# EAGLE design HighPass_V_1_0 (EAGLE 9.5.2)
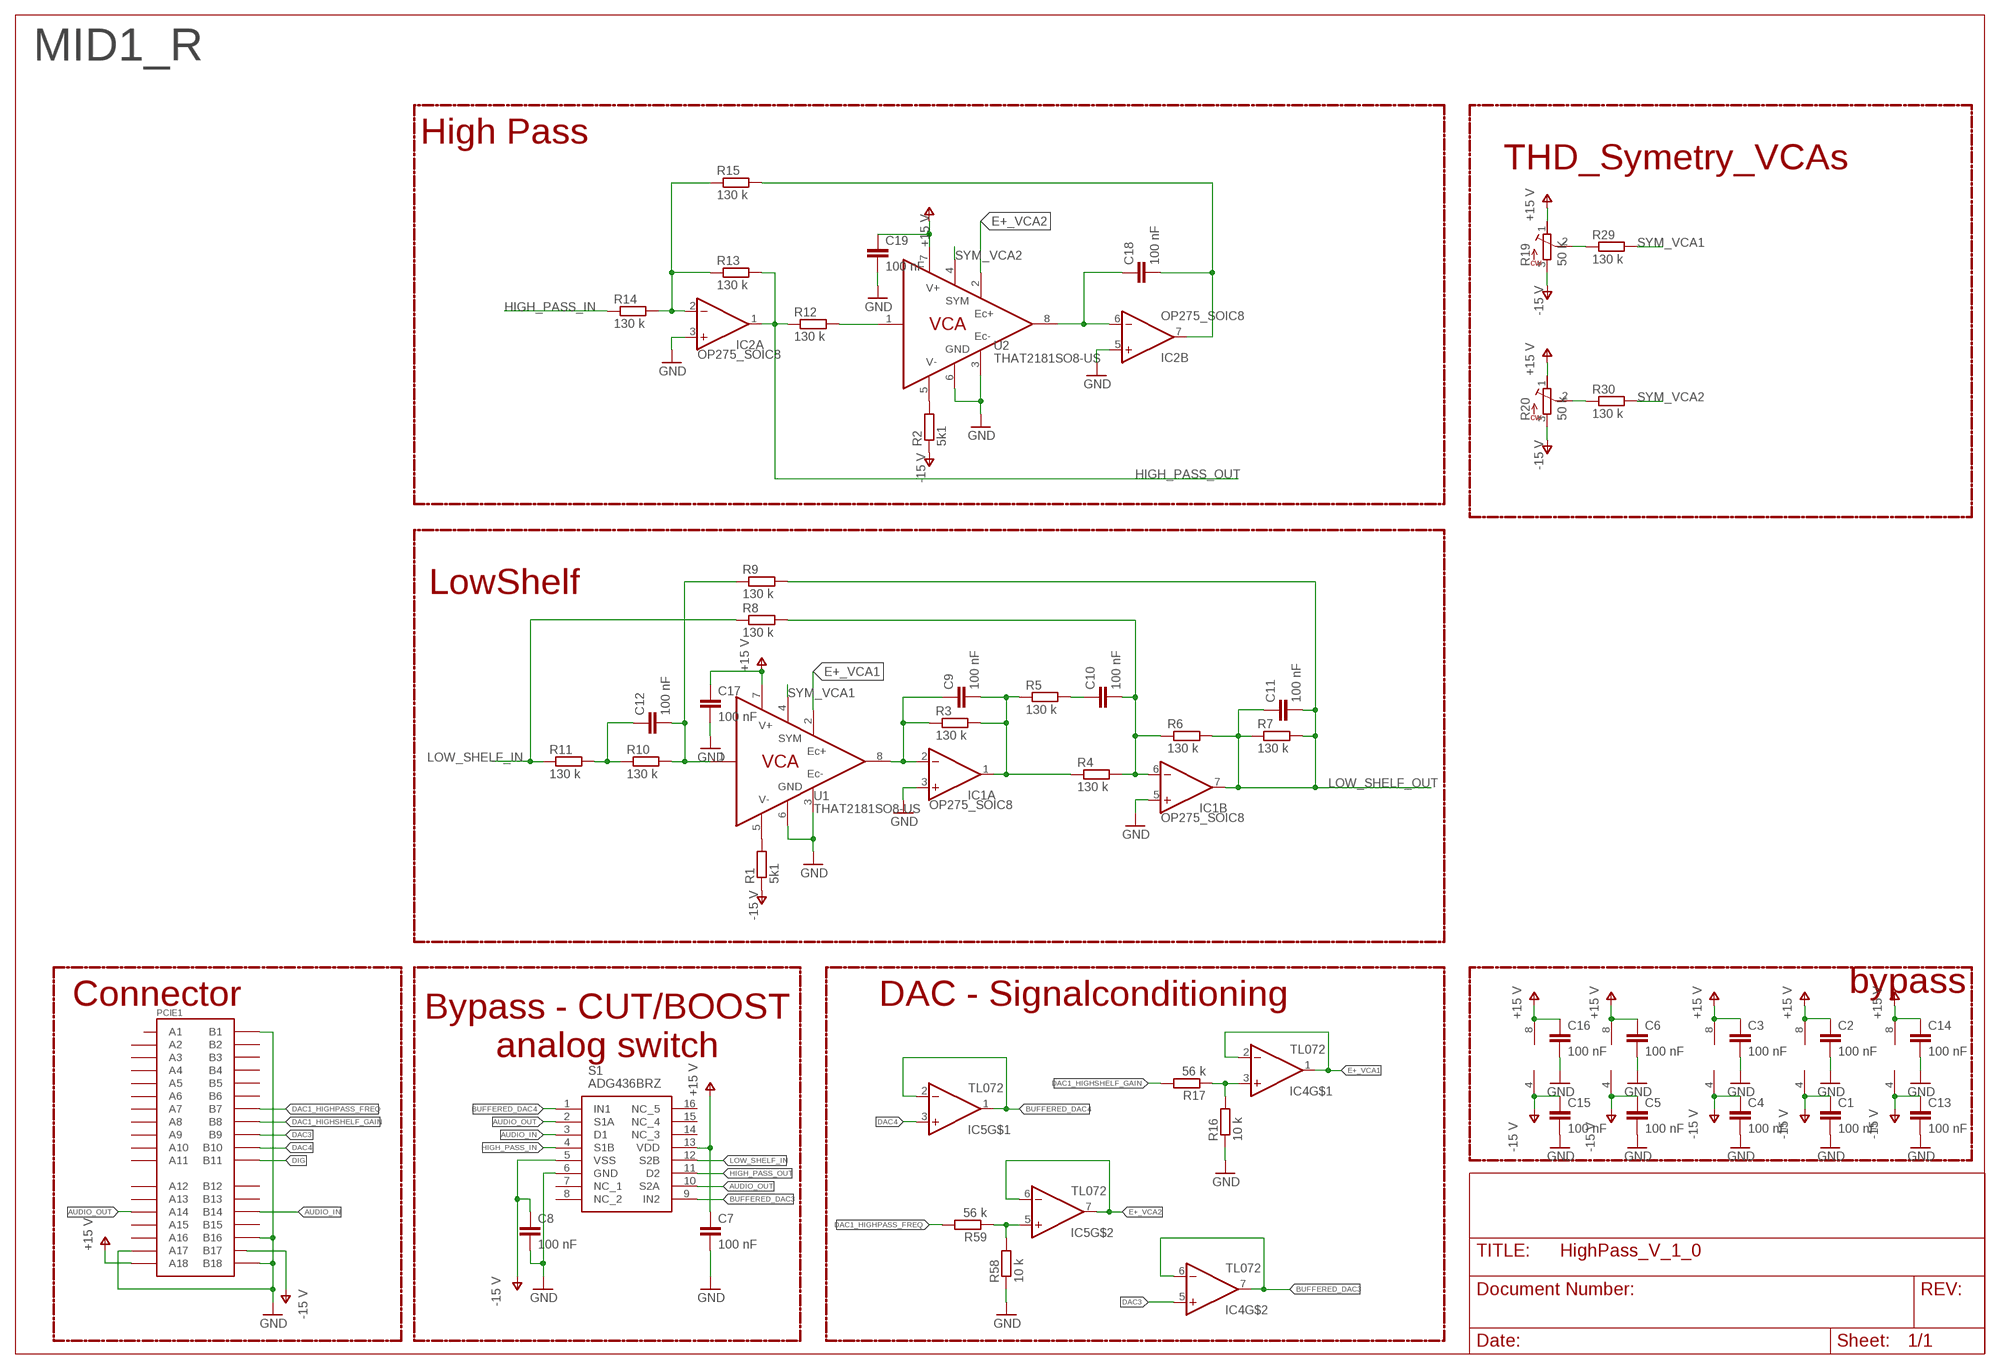
[diagram p0: schematic, sheet 1]

## Parts
C1  100 nF  CAPACITOR_0603  [C0603]
C2  100 nF  CAPACITOR_0603  [C0603]
C3  100 nF  CAPACITOR_0603  [C0603]
C4  100 nF  CAPACITOR_0603  [C0603]
C5  100 nF  CAPACITOR_0603  [C0603]
C6  100 nF  CAPACITOR_0603  [C0603]
C7  100 nF  CAPACITOR_0603  [C0603]
C8  100 nF  CAPACITOR_0603  [C0603]
C9  100 nF  CAPACITOR_0603  [C0603]
C10  100 nF  CAPACITOR_0603  [C0603]
C11  100 nF  CAPACITOR_0603  [C0603]
C12  100 nF  CAPACITOR_0603  [C0603]
C13  100 nF  CAPACITOR_0603  [C0603]
C14  100 nF  CAPACITOR_0603  [C0603]
C15  100 nF  CAPACITOR_0603  [C0603]
C16  100 nF  CAPACITOR_0603  [C0603]
C17  100 nF  CAPACITOR_0603  [C0603]
C18  100 nF  CAPACITOR_0603  [C0603]
C19  100 nF  CAPACITOR_0603  [C0603]
IC1  OP275_SOIC8  [SOIC8]
IC2  OP275_SOIC8  [SOIC8]
IC3  OP275_SOIC8  [SOIC8]
IC4  TL072  [SOIC8]
IC5  TL072  [SOIC8]
PCIE1  PCIE-36-EDGE  [PCIE-36-EDGE]
R1  5k1  RESISTOR_0603  [R0603]
R2  5k1  RESISTOR_0603  [R0603]
R3  130 k  RESISTOR_0603  [R0603]
R4  130 k  RESISTOR_0603  [R0603]
R5  130 k  RESISTOR_0603  [R0603]
R6  130 k  RESISTOR_0603  [R0603]
R7  130 k  RESISTOR_0603  [R0603]
R8  130 k  RESISTOR_0603  [R0603]
R9  130 k  RESISTOR_0603  [R0603]
R10  130 k  RESISTOR_0603  [R0603]
R11  130 k  RESISTOR_0603  [R0603]
R12  130 k  RESISTOR_0603  [R0603]
R13  130 k  RESISTOR_0603  [R0603]
R14  130 k  RESISTOR_0603  [R0603]
R15  130 k  RESISTOR_0603  [R0603]
R16  10 k  RESISTOR_0603  [R0603]
R17  56 k  RESISTOR_0603  [R0603]
R19  50 K  R_TRIMMER_SMDTC33X2503G  [TC33X2503G]
R20  50 k  R_TRIMMER_SMDTC33X2503G  [TC33X2503G]
R29  130 k  RESISTOR_0603  [R0603]
R30  130 k  RESISTOR_0603  [R0603]
R58  10 k  RESISTOR_0603  [R0603]
R59  56 k  RESISTOR_0603  [R0603]
S1  ADG436BRZ  [SOIC127P600X175-16N]
U1  THAT2181SO8-US  [SO08]
U2  THAT2181SO8-US  [SO08]

## Nets
AUDIO_IN: PCIE1.B14 S1.3(D1)
AUDIO_OUT: PCIE1.A14 S1.2(S1A) S1.10(S2A)
BUFFERED_DAC3: IC4.6(-IN) IC4.7(OUT) S1.9(IN2)
BUFFERED_DAC4: IC5.1(OUT) IC5.2(-IN) S1.1(IN1)
DAC1_HIGHPASS_FREQ: PCIE1.B7 R59.2
DAC1_HIGHSHELF_GAIN: PCIE1.B8 R17.2
DAC3: IC4.5(+IN) PCIE1.B9
DAC4: IC5.3(+IN) PCIE1.B10
DIG: PCIE1.B11
E+_VCA1: IC4.1(OUT) IC4.2(-IN) U1.2(EC+)
E+_VCA2: IC5.6(-IN) IC5.7(OUT) U2.2(EC+)
GND: C1.2 C2.2 C3.2 C4.2 C5.2 C6.2 C7.2 C8.2 C13.2 C14.2 C15.2 C16.2 C17.2 C19.2 IC1.3(A:+IN) IC1.5(B:+IN) IC2.3(A:+IN) IC2.5(B:+IN) PCIE1.A17 PCIE1.B1 PCIE1.B16 PCIE1.B18 R16.1 R58.1 S1.6(GND) U1.3(EC-) U1.6(GND) U2.3(EC-) U2.6(GND)
HIGH_PASS_IN: R14.1 S1.4(S1B)
HIGH_PASS_OUT: IC2.1(A:OUT) R12.1 R13.2 S1.11(D2)
LOW_SHELF_IN: R8.1 R11.1 S1.12(S2B)
LOW_SHELF_OUT: C11.1 C11.2 IC1.7(B:OUT) R6.2 R7.1 R7.2 R9.2
N$1: R1.2 U1.5(V-)
N$2: R2.2 U2.5(V-)
N$3: C9.1 IC1.2(A:-IN) R3.1 U1.8(OUT)
N$4: C10.2 IC1.6(B:-IN) R4.2 R6.1 R8.2
N$5: C9.2 IC1.1(A:OUT) R3.2 R4.1 R5.1
N$6: C10.1 R5.2
N$7: R12.2 U2.1(IN)
N$8: C12.2 R9.1 R10.2 U1.1(IN)
N$9: IC4.3(+IN) R16.2 R17.1
N$11: C12.1 R10.1 R11.2
N$13: IC2.2(A:-IN) R13.1 R14.2 R15.1
N$16: C18.2 IC2.7(B:OUT) R15.2
N$17: C18.1 IC2.6(B:-IN) U2.8(OUT)
N$20: R19.2 R29.1
N$22: R20.2 R30.1
N$66: IC5.5(+IN) R58.2 R59.1
SYM_VCA1: R29.2 U1.4(SYM)
SYM_VCA2: R30.2 U2.4(SYM)
V+: C2.1 C3.1 C6.1 C7.1 C14.1 C16.1 C17.1 C19.1 IC1.8(P:V+) IC2.8(P:V+) IC3.8(P:V+) IC4.8(V+) IC5.8(V+) PCIE1.A18 R19.1 R20.1 S1.13(VDD) U1.7(V+) U2.7(V+) ; supply symbol labelled +15 V
V-: C1.1 C4.1 C5.1 C8.1 C13.1 C15.1 IC1.4(P:V-) IC2.4(P:V-) IC3.4(P:V-) IC4.4(V-) IC5.4(V-) PCIE1.B17 R1.1 R2.1 R19.3 R20.3 S1.5(VSS) ; supply symbol labelled -15 V
Unconnected: IC3.1(A:OUT) IC3.2(A:-IN) IC3.3(A:+IN) IC3.5(B:+IN) IC3.6(B:-IN) IC3.7(B:OUT) PCIE1.A1 PCIE1.A2 PCIE1.A3 PCIE1.A4 PCIE1.A5 PCIE1.A6 PCIE1.A7 PCIE1.A8 PCIE1.A9 PCIE1.A10 PCIE1.A11 PCIE1.A12 PCIE1.A13 PCIE1.A15 PCIE1.A16 PCIE1.B2 PCIE1.B3 PCIE1.B4 PCIE1.B5 PCIE1.B6 PCIE1.B12 PCIE1.B13 PCIE1.B15 S1.7(NC_1) S1.8(NC_2) S1.14(NC_3) S1.15(NC_4) S1.16(NC_5)

## Notes on the sheet
- MID1_R
- High Pass
- THD_Symetry_VCAs
- LowShelf
- bypass
- Connector | DAC - Signalconditioning
- Bypass - CUT/BOOST
  analog switch

## Library data of the parts
C1-C19 = passive components:CAPACITOR: ceramic capacitor
IC1-IC3 = OP-AMPS:OP275: Dual Very Low Noise Precision Operational Amplifier Source: http://www.analog.com/static/imported-files/data_sheets/OP270.pdf; MOUSER_PART_NUMBER: 584-OP275GSZ-R7
IC4 IC5 = OP-AMPS:TL072: Datasheet: http://www.ti.com/general/docs/suppproductinfo.tsp?distId=26&gotoUrl=http%3A%2F%2Fwww.ti.com%2Flit%2Fgpn%2Ftl072; MOUSER_PART_NUMBER: 595-TL072CDR
PCIE1 = electro_mechanical:PCIE-36-*: PCI-E 36-way connectors
R1-R17 R29 R30 R58 R59 = passive components:RESISTOR: +/- 5 % resistor
R19 R20 = electro_mechanical:R_TRIMMER_SMD
S1 = analog switches:ADG436BRZ: Analog Devices ADG436BRZ, Analogue SPDT Switch Dual SPDT, 5 V, 9 V, 12 V, 15 V, 18 V, 24 V, 28 V, 16-Pin SOIC Source: Datasheet <https://componentsearchengine.com/Datasheets/1/ADG436BRZ.pdf>; DESCRIPTION: Analog Devices ADG436BRZ, Analogue SPDT Switch Dual SPDT, 5 V, 9 V, 12 V, 15 V, 18 V, 24 V, 28 V, 16-Pin SOIC; HEIGHT: 1.75mm; MANUFACTURER_NAME: Analog Devices; MANUFACTURER_PART_NUMBER: ADG436BRZ; MOUSER_PART_NUMBER: 584-ADG436BRZ; MOUSER_PRICE-STOCK: https://www.mouser.com/Search/Refine.aspx?Keyword=584-ADG436BRZ
U1 U2 = THAT_Library:THAT2181: VCA Trimmable IC; MOUSER_PART_NUMBER: 887-2181CS08-U

## Board
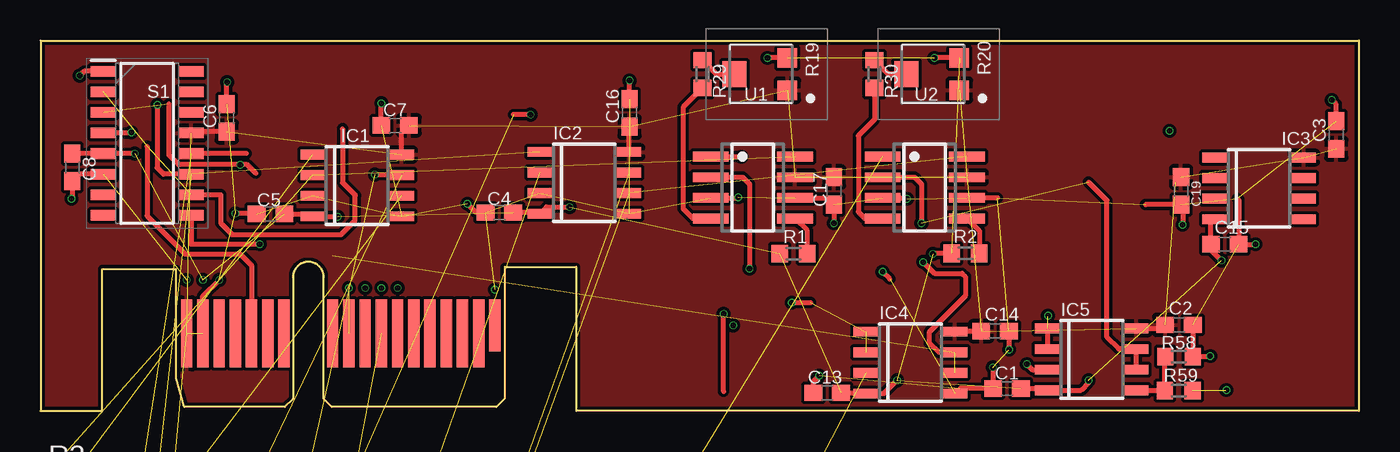
[diagram p1: board, top side]
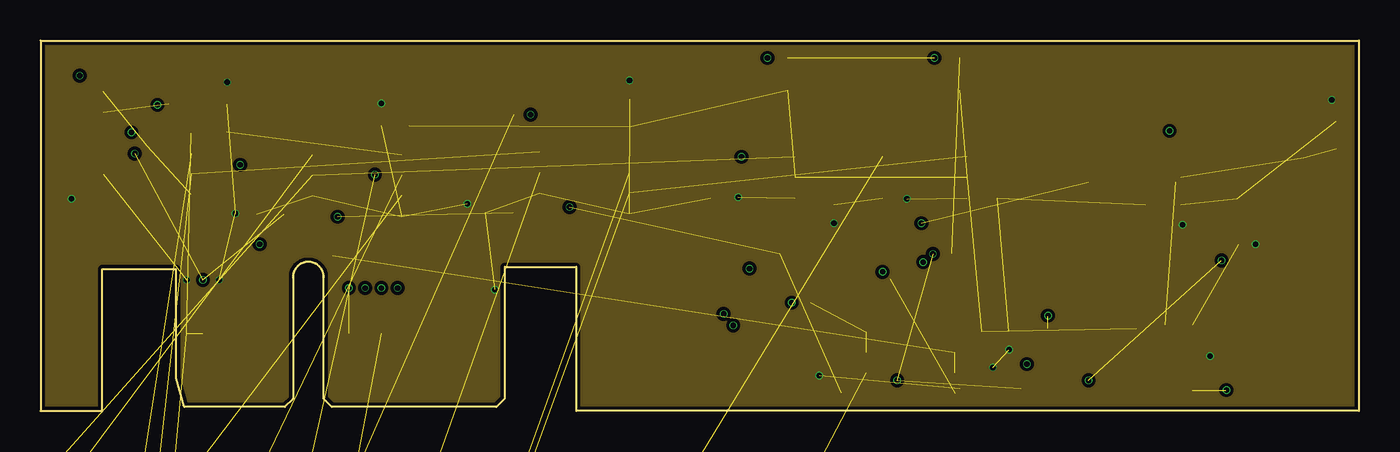
[diagram p2: board, inner layer GND]
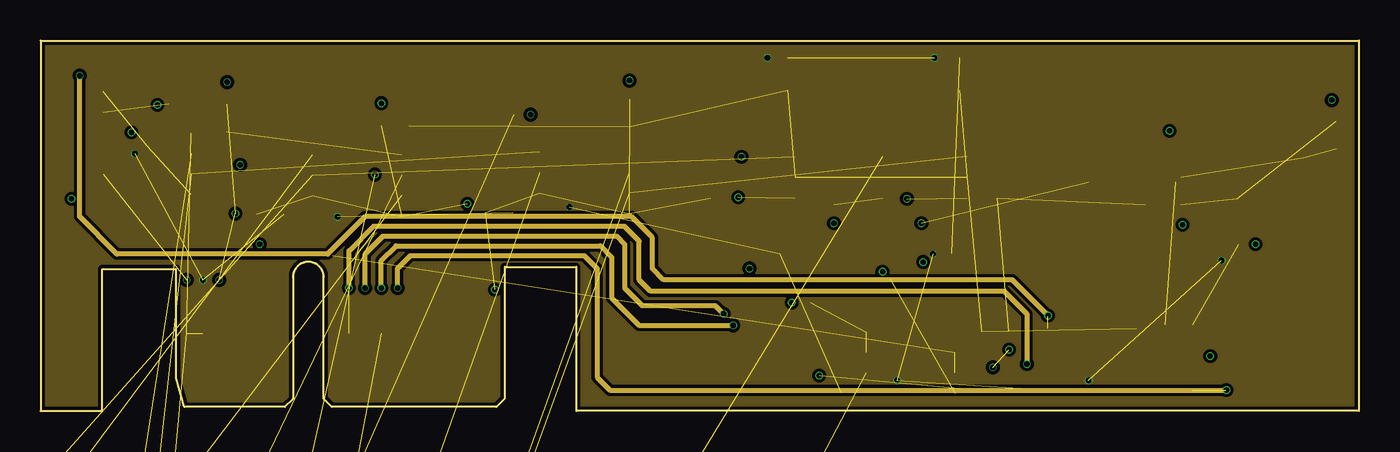
[diagram p3: board, inner layer V-]
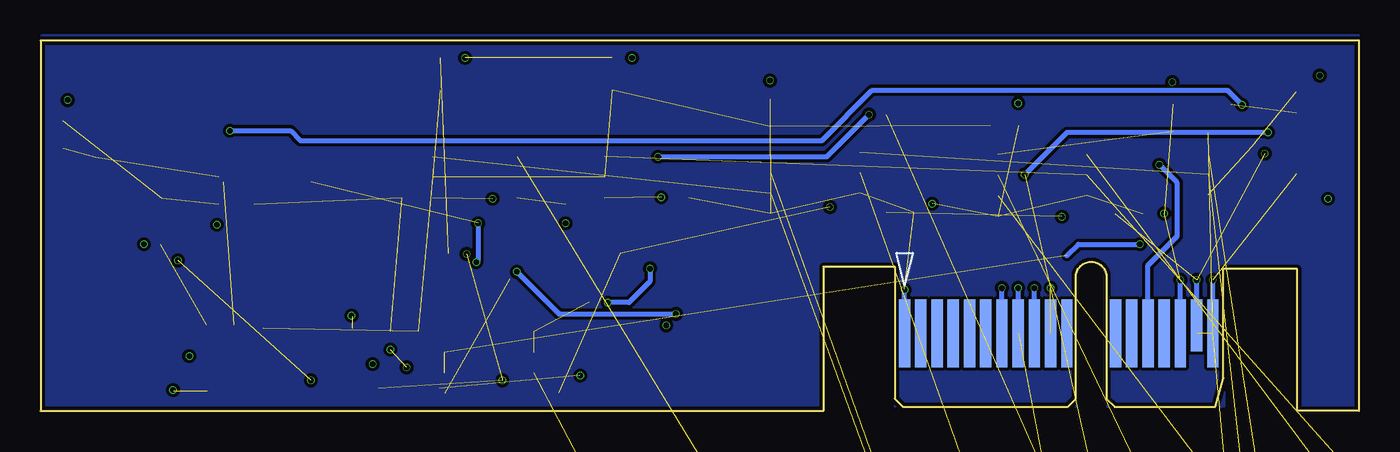
[diagram p4: board, bottom side, seen from below]

Size 81.28 x 22.86 mm. Coordinates in mm from the lower left corner, seen from the top.
Copper layers (1*2+15*16): V+ 0.018mm / dielectric 0.362mm / GND 0.035mm / dielectric 0.71mm / V- 0.035mm / dielectric 0.362mm / Bottom 0.018mm
Design rules "4layer": minimum track width 0.2mm, minimum drill 0.2mm, track to track 0.2mm, track to pad 0.1mm, pad to pad 0.1mm, via to via 0.1mm, smd to smd 0.1mm, copper to edge 0.2mm, drill to drill 0.21mm, minimum pad ring 0.25mm, minimum via ring 0.05mm, stop-mask expansion 0.01mm, vias tented up to drill 0mil, thermal gap 10mil

### Footprints (pad centres in the part's own frame; a part is rotated, then mirrored left to right if it is on the bottom)
C0603 = smd 1.1 x 1: 1 -0.85,0; 2 0.85,0
SOIC8 = smd 0.6 x 1.5: 1 -1.905,-2.75; 2 -0.635,-2.75; 3 0.635,-2.75; 4 1.905,-2.75; 5 1.905,2.75; 6 0.635,2.75; 7 -0.635,2.75; 8 -1.905,2.75
PCIE-36-EDGE = smd 0.7 x 3.2 bottom: A1 -11.5,-3.6 | smd 0.7 x 4.2 bottom: A2 -10.5,-4.1; A3 -9.5,-4.1; A4 -8.5,-4.1; A5 -7.5,-4.1; A6 -6.5,-4.1; A7 -5.5,-4.1; A8 -4.5,-4.1; A9 -3.5,-4.1; A10 -2.5,-4.1; A11 -1.5,-4.1; A12 1.5,-4.1; A13 2.5,-4.1; A14 3.5,-4.1; A15 4.5,-4.1; A16 5.5,-4.1; A17 6.5,-4.1; A18 7.5,-4.1 | smd 0.7 x 4.2: B1 -11.5,-4.1; B2 -10.5,-4.1; B3 -9.5,-4.1; B4 -8.5,-4.1; B5 -7.5,-4.1; B6 -6.5,-4.1; B7 -5.5,-4.1; B8 -4.5,-4.1; B9 -3.5,-4.1; B10 -2.5,-4.1; B11 -1.5,-4.1; B12 1.5,-4.1; B13 2.5,-4.1; B14 3.5,-4.1; B15 4.5,-4.1; B16 5.5,-4.1; B18 7.5,-4.1 | smd 0.7 x 3.2: B17 6.5,-3.6
R0603 = smd 1 x 1.1: 1 -0.85,0; 2 0.85,0
TC33X2503G = smd 1.2 x 1.2: 1 -1,-1.625; 3 1,-1.625 | smd 1.6 x 1.5: 2 0,1.625
SOIC127P600X175-16N = smd 1.525 x 0.65: 1 -2.712,4.445; 2 -2.712,3.175; 3 -2.712,1.905; 4 -2.712,0.635; 5 -2.712,-0.635; 6 -2.712,-1.905; 7 -2.712,-3.175; 8 -2.712,-4.445; 9 2.712,-4.445; 10 2.712,-3.175; 11 2.712,-1.905; 12 2.712,-0.635; 13 2.712,0.635; 14 2.712,1.905; 15 2.712,3.175; 16 2.712,4.445
SO08 = smd 0.6 x 2.2: 1 -1.905,-2.6; 2 -0.635,-2.6; 3 0.635,-2.6; 4 1.905,-2.6; 5 1.905,2.6; 6 0.635,2.6; 7 -0.635,2.6; 8 -1.905,2.6

### Placement (x,y rotation side)
C1  59.58,1.39 180 top
C2  70.18,5.31 0 top
C3  79.88,17.03 90 top
C4  28.28,12.25 180 top
C5  14.18,12.17 180 top
C6  11.48,18.09 90 top
C7  21.86,17.62 180 top
C8  1.96,15.04 270 top
C9  1.11,-8.61 0 top  (outside the outline)
C10  1.11,-23.01 0 top  (outside the outline)
C11  1.11,-37.41 0 top  (outside the outline)
C12  1.11,-61.61 0 top  (outside the outline)
C13  48.49,1.13 180 top
C14  58.84,4.93 0 top
C15  73.01,10.29 0 top
C16  36.31,18.39 90 top
C17  48.91,13.59 270 top
C18  1.01,-85.81 0 top  (outside the outline)
C19  70.31,13.59 270 top
IC1  19.52,13.92 270 top
IC2  33.52,14.08 270 top
IC3  75.12,13.74 270 top
IC4  53.63,2.99 270 top
IC5  64.81,3.19 270 top
PCIE1  16.51,8.89 0 bottom
R1  46.42,9.71 0 top
R2  57.02,9.73 0 top
R3  1.11,-4.01 0 top  (outside the outline)
R4  1.11,-13.51 0 top  (outside the outline)
R5  1.11,-18.41 0 top  (outside the outline)
R6  1.11,-27.91 0 top  (outside the outline)
R7  1.11,-32.81 0 top  (outside the outline)
R8  1.11,-42.31 0 top  (outside the outline)
R9  1.11,-47.21 0 top  (outside the outline)
R10  1.11,-52.11 0 top  (outside the outline)
R11  1.11,-57.01 0 top  (outside the outline)
R12  1.01,-66.51 0 top  (outside the outline)
R13  1.01,-71.41 0 top  (outside the outline)
R14  1.01,-76.31 0 top  (outside the outline)
R15  1.01,-81.21 0 top  (outside the outline)
R16  1.01,-90.71 0 top  (outside the outline)
R17  1.01,-95.61 0 top  (outside the outline)
R19  44.41,20.79 90 top
R20  55.01,20.79 90 top
R29  40.81,20.79 270 top
R30  51.41,20.79 270 top
R58  70.19,3.36 180 top
R59  70.17,1.26 0 top
S1  6.57,16.52 0 top
U1  43.91,13.79 270 top
U2  54.51,13.79 270 top

### Tracks (layer width: path | path; a pad name or v marks a point on that pad's centre or on a via)
AUDIO_IN  (via drill 0.35)  (1 unrouted)
  V+ 0.305: 13.27,14.67 12.75,15.19 v12.31,15.19 8.51,15.19 7.91,15.79 7.91,18.95
  Bottom 0.305: PCIE1.B14 13.01,8.99 11.21,10.79 11.21,14.09 v12.31,15.19
AUDIO_OUT  (2 unrouted)
  V+ 0.305: 6.57,16.33 6.57,12.03 8.91,9.69 12.31,9.69 13.01,8.99 PCIE1.A14 | 18.61,17.41 18.61,14.09 19.42,13.29 19.39,13.29 19.39,11.75 18.52,10.89 11.81,10.89 11.11,11.59 11.11,13.35 S1.10
BOTTOM
  pour Bottom: 0.01,-0.01 3.71,-0.01 3.71,8.79 8.31,8.79 8.31,0.29 15.51,0.29 15.51,9.19 17.41,9.19 17.41,0.29 28.61,0.29 28.61,8.89 33.01,8.89 33.01,0.09 81.21,0.09 81.21,23.19 0.01,23.19
BUFFERED_DAC3  (via drill 0.35)  (2 unrouted)
  V+ 0.305: S1.9 9.28,10.29 v13.51,10.29
  Bottom 0.305: v13.51,10.29 17.31,10.29 18.01,9.59
BUFFERED_DAC4  (via drill 0.35)  (1 unrouted)
  V+ 0.305: IC5.1 IC5.2 | 62.06,5.84 v62.11,5.89 | v2.41,20.69 2.69,20.96 S1.1
  V- 0.305: v62.11,5.89 59.91,8.09 38.41,8.09 37.72,8.79 37.72,10.7 36.42,11.99 20.01,11.99 17.71,9.69 4.71,9.69 2.41,11.99 v2.41,20.69
DAC1_HIGHPASS_FREQ  (via drill 0.35)  (1 unrouted)
  V+ 0.305: v73.11,1.29 73.08,1.26
  V- 0.305: v22.01,7.59 22.01,8.79 22.81,9.59 33.51,9.59 34.31,8.79 34.31,2.09 35.11,1.29 v73.11,1.29
  Bottom 0.305: PCIE1.B7 v22.01,7.59
DAC1_HIGHSHELF_GAIN  (via drill 0.35)  (1 unrouted)
  V+ 0.305: v42.71,5.29 42.76,5.34
  V- 0.305: v21.01,7.59 21.01,9.29 21.91,10.19 34.51,10.19 35.21,9.49 35.21,6.99 36.91,5.29 v42.71,5.29
  Bottom 0.305: PCIE1.B8 v21.01,7.59
DAC3  (via drill 0.35)  (1 unrouted)
  V+ 0.305: 42.11,1.21 v42.11,5.99 | 52.36,8.14 v51.91,8.59
  V- 0.305: v20.01,7.59 20.01,9.69 21.11,10.79 35.51,10.79 36.01,10.29 36.01,7.59 37.11,6.49 41.61,6.49 v42.11,5.99
  Bottom 0.305: PCIE1.B9 v20.01,7.59 | v51.91,8.59 49.31,5.99 v42.11,5.99
DAC4  (via drill 0.35)  (1 unrouted)
  V+ 0.305: v60.81,2.89 61.14,2.56 IC5.3
  V- 0.305: v19.01,7.59 19.01,9.89 20.51,11.39 36.01,11.39 36.91,10.49 36.91,8.09 37.61,7.39 59.41,7.39 60.81,5.99 v60.81,2.89
E+_VCA1  (via drill 0.35)  (2 unrouted)
  V+ 0.305: U1.2 43.28,14.43 43.71,13.99 v43.71,8.79 | v46.31,6.69 47.48,6.69
  Bottom 0.305: v43.71,8.79 43.71,7.99 45.01,6.69 v46.31,6.69
E+_VCA2  (via drill 0.35)  (1 unrouted)
  V+ 0.305: 55.38,3.63 54.81,4.19 54.81,4.89 56.92,7 57.01,7.09 57.01,8.29 56.81,8.49 55.11,8.49 v54.41,9.19 | U2.2 53.88,14.43 54.31,13.99 v54.31,11.59 | IC5.6 IC5.7 66.48,3.83 65.75,4.56 65.75,12.99 64.61,14.12
  Bottom 0.305: v54.31,11.59 54.31,9.29 v54.41,9.19
GND  (via drill 0.35)  (24 unrouted)
  V+ 0.305: S1.6 2.39,14.62 C8.2 1.96,13.09 v1.91,13.09 | C6.2 11.48,20.26 v11.51,20.29 | C7.2 v21.01,18.99 | C5.2 13.31,12.19 v12.01,12.19 | PCIE1.A17 10.01,7.09 v11.01,8.09 | C2.2 R58.1 72.08,3.36 v72.11,3.39 | C13.2 47.64,1.82 v48.01,2.19 | 56.69,1.39 C1.2 58.73,2.67 v58.71,2.69 | C14.2 59.71,4.91 v59.71,3.79 | v74.91,10.29 C15.2 73.86,13.04 73.8,13.11 | C3.2 79.88,18.92 v79.61,19.19 | 68.12,12.74 C19.2 70.41,12.64 v70.41,11.49 | 59,13.16 U2.6 | U2.3 53.34,13.16 v53.41,13.09 | C4.2 26.85,12.25 v26.31,12.79 | C16.2 v36.31,20.39 | U1.6 48.5,13.16 C17.2 v48.91,11.59 | U1.3 42.98,13.16 v43.01,13.19
  Bottom 0.305: PCIE1.B18 v9.01,8.09 | PCIE1.B16 v11.01,8.09 | PCIE1.B1 v28.01,7.49
  pour GND: 0.01,-0.01 3.81,-0.01 3.81,8.79 8.31,8.79 8.31,0.29 15.51,0.29 15.51,9.19 17.41,9.19 17.41,0.29 28.61,0.29 28.61,8.89 33.11,8.89 33.11,0.09 81.21,0.09 81.21,23.09 0.01,23.09
HIGH_PASS_IN  (via drill 0.35)  (1 unrouted)
  V+ 0.305: v5.61,17.19 5.58,17.16 S1.4 | v20.61,14.59 22.24,14.59
  Bottom 0.305: v5.61,17.19 18.01,17.19 v20.61,14.59
HIGH_PASS_OUT  (via drill 0.35)  (3 unrouted)
  V+ 0.305: v7.21,18.89 7.18,18.86 7.18,15.02 7.58,14.62 S1.11 | 69.65,17.33 v69.61,17.29
  Bottom 0.305: v7.21,18.89 8.11,19.79 30.01,19.79 33.11,16.69 65.27,16.69 65.87,17.29 v69.61,17.29
LOW_SHELF_IN  (2 unrouted)
  V+ 0.305: 12.69,15.88 S1.12
LOW_SHELF_OUT  (6 unrouted)
N$1
  V+ 0.305: R1.2 47.27,11.12 U1.5
N$2
  V+ 0.305: U2.5 57.87,11.12 R2.2
N$3  (3 unrouted)
N$4  (4 unrouted)
N$5  (4 unrouted)
N$6  (1 unrouted)
N$7  (1 unrouted)
N$8  (via drill 0.35)  (3 unrouted)
  V+ 0.305: U1.1 v43.2,15.7 v43.21,15.69 | v30.21,18.29 29.16,18.29
  Bottom 0.305: v43.21,15.69 32.81,15.69 v30.21,18.29
N$9  (2 unrouted)
N$11  (2 unrouted)
N$13  (3 unrouted)
N$16  (2 unrouted)
N$17  (2 unrouted)
N$20
  V+ 0.305: R29.1 41.66,20.79 R19.2
N$22
  V+ 0.305: R20.2 52.26,20.79 R30.1
N$66
  V+ 0.305: IC5.5 67.59,1.26 R59.1 69.32,3.34 R58.2
SYM_VCA1
  V+ 0.305: R29.2 39.61,18.74 39.61,12.49 40.22,11.88 U1.4
SYM_VCA2
  V+ 0.305: R30.2 51.41,17.99 50.41,16.99 50.41,12.29 50.81,11.88 U2.4
V+  (13 unrouted)
  V+ 0.305: C6.1 9.37,17.24 S1.13 | IC1.8 22.27,17.18 C7.1 | C14.1 56.42,4.93 IC4.8 | IC5.8 69.12,5.1 C2.1 | C19.1 70,14.12 | 57.12,14.44 U2.7 | IC2.8 36.27,17.5 C16.1
  pour V+: 0.01,-0.01 3.81,-0.01 3.81,8.79 8.41,8.79 8.41,8.69 8.31,8.69 8.31,0.29 15.51,0.29 15.51,9.19 17.41,9.19 17.41,0.29 28.61,0.29 28.61,8.89 33.11,8.89 33.11,0.09 81.21,0.09 81.21,22.99 0.01,22.99
V-  (via drill 0.35)  (10 unrouted)
  V+ 0.305: C8.1 S1.5 v5.81,15.88 v5.81,15.89 | C5.1 16.62,12.17 IC1.4 18.29,12.02 v18.31,11.99 | C13.1 49.39,1.09 IC4.4 52,1.09 v52.81,1.89 | C1.1 61.95,1.39 IC5.4 64.16,1.29 64.61,1.74 v64.61,1.89 | IC3.4 72.16,11.62 C15.1 72.16,9.94 v72.81,9.29 | R20.3 v55.11,21.79 | R2.1 55.05,9.73 v55.01,9.69 | R19.3 v44.81,21.79 | C4.1 30.7,12.25 IC2.4 31.19,12.59 v32.61,12.59
  Bottom 0.305: PCIE1.B17 v10.01,8.09
  pour V-: 0.01,-0.01 3.71,-0.01 3.71,8.79 8.31,8.79 8.31,0.29 15.51,0.29 15.51,9.19 17.41,9.19 17.41,0.29 28.61,0.29 28.61,8.89 33.11,8.89 33.11,0.09 81.21,0.09 81.21,23.19 0.01,23.19